# Altium schematic sheet stm32nes.SchDoc
size A3
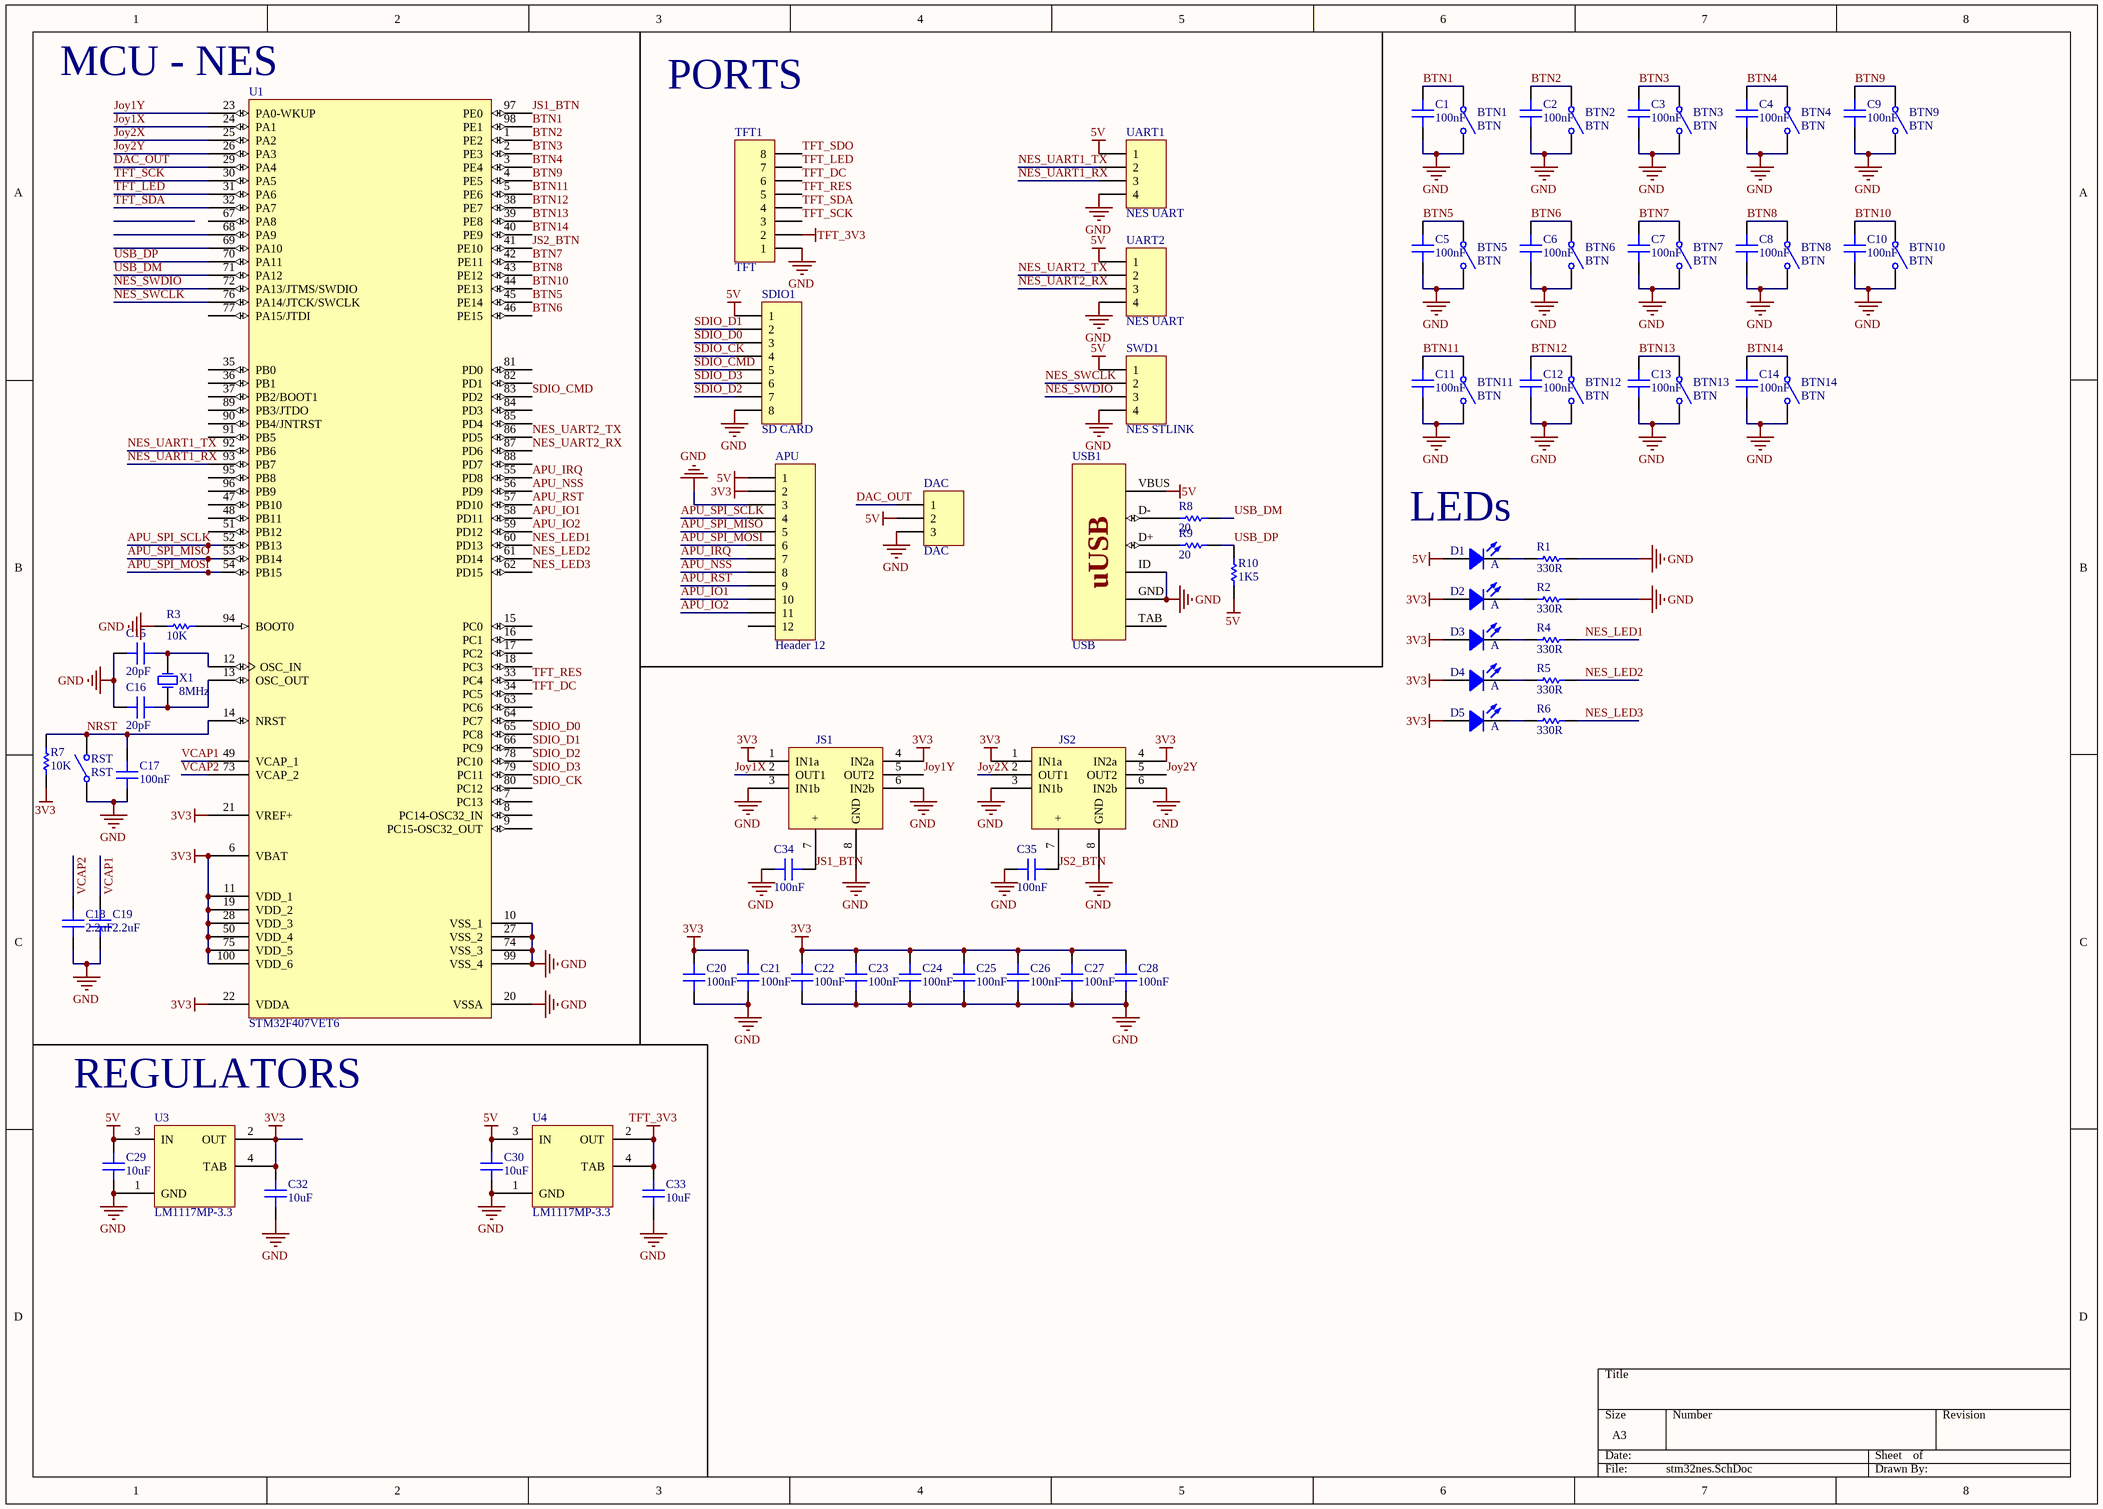
[diagram p0: stm32nes.SchDoc]

## Parts
APU  Header 12  [HDR1X12]
BTN1  BTN  [PCBComponent_1]
BTN2  BTN  [PCBComponent_1]
BTN3  BTN  [PCBComponent_1]
BTN4  BTN  [PCBComponent_1]
BTN5  BTN  [PCBComponent_1]
BTN6  BTN  [PCBComponent_1]
BTN7  BTN  [PCBComponent_1]
BTN8  BTN  [PCBComponent_1]
BTN9  BTN  [PCBComponent_1]
BTN10  BTN  [PCBComponent_1]
BTN11  BTN  [PCBComponent_1]
BTN12  BTN  [PCBComponent_1]
BTN13  BTN  [PCBComponent_1]
BTN14  BTN  [PCBComponent_1]
C1  100nF  [CC2012-0805]
C2  100nF  [CC2012-0805]
C3  100nF  [CC2012-0805]
C4  100nF  [CC2012-0805]
C5  100nF  [CC2012-0805]
C6  100nF  [CC2012-0805]
C7  100nF  [CC2012-0805]
C8  100nF  [CC2012-0805]
C9  100nF  [CC2012-0805]
C10  100nF  [CC2012-0805]
C11  100nF  [CC2012-0805]
C12  100nF  [CC2012-0805]
C13  100nF  [CC2012-0805]
C14  100nF  [CC2012-0805]
C15  20pF  [CC2012-0805]
C16  20pF  [CC2012-0805]
C17  100nF  [CC2012-0805]
C18  2.2uF  [CC2012-0805]
C19  2.2uF  [CC2012-0805]
C20  100nF  [CC2012-0805]
C21  100nF  [CC2012-0805]
C22  100nF  [CC2012-0805]
C23  100nF  [CC2012-0805]
C24  100nF  [CC2012-0805]
C25  100nF  [CC2012-0805]
C26  100nF  [CC2012-0805]
C27  100nF  [CC2012-0805]
C28  100nF  [CC2012-0805]
C29  10uF  [CC2012-0805]
C30  10uF  [CC2012-0805]
C32  10uF  [CC2012-0805]
C33  10uF  [CC2012-0805]
C34  100nF  [CC2012-0805]
C35  100nF  [CC2012-0805]
D1  A  [D0805]
D2  A  [D0805]
D3  A  [D0805]
D4  A  [D0805]
D5  A  [D0805]
DAC  DAC  [LOCKEDHDR-3W]
JS1  Joystick  [B10K-1]  (value not drawn)
JS2  Joystick  [B10K-1]  (value not drawn)
R1  330R  [CR2012-0805]
R2  330R  [CR2012-0805]
R3  10K  [CR2012-0805]
R4  330R  [CR2012-0805]
R5  330R  [CR2012-0805]
R6  330R  [CR2012-0805]
R7  10K  [CR2012-0805]
R8  20  [CR2012-0805]
R9  20  [CR2012-0805]
R10  1K5  [CR2012-0805]
RST  RST  [PUSH SWITCH 2-PIN]
SDIO1  SD CARD  [HDR1X8]
SWD1  NES STLINK  [LOCKEDHDR-4W]
TFT1  TFT  [HDR1X8]
U1  STM32F407VET6  [LQFP100_N]
U3  LM1117MP-3.3  [MP04A_N]
U4  LM1117MP-3.3  [MP04A_N]
UART1  NES UART  [LOCKEDHDR-4W]
UART2  NES UART  [LOCKEDHDR-4W]
USB1  USB  [USB-UB-S-HM]
X1  8MHz  [BCY-W2/E4.7]

## Nets
3V3: APU.2 C20.2 C21.2 C22.2 C23.2 C24.2 C25.2 C26.2 C27.2 C28.2 C32.2 D2.1(A) D3.1(A) D4.1(A) D5.1(A) JS1.1(IN1a) JS1.4(IN2a) JS2.1(IN1a) JS2.4(IN2a) R7.1 U1.6(VBAT) U1.11(VDD_1) U1.19(VDD_2) U1.21(VREF+) U1.22(VDDA) U1.28(VDD_3) U1.50(VDD_4) U1.75(VDD_5) U1.100(VDD_6) U3.2(OUT) U3.4(TAB)
5V: APU.1 C29.2 C30.2 D1.1(A) DAC.2 R10.2 SDIO1.1 SWD1.1 U3.3(IN) U4.3(IN) UART1.1 UART2.1 USB1.VBUS
GND: APU.3 BTN1.2(NO) BTN2.2(NO) BTN3.2(NO) BTN4.2(NO) BTN5.2(NO) BTN6.2(NO) BTN7.2(NO) BTN8.2(NO) BTN9.2(NO) BTN10.2(NO) BTN11.2(NO) BTN12.2(NO) BTN13.2(NO) BTN14.2(NO) C1.2 C2.2 C3.2 C4.2 C5.2 C6.2 C7.2 C8.2 C9.2 C10.2 C11.2 C12.2 C13.2 C14.2 C15.2 C16.2 C17.2 C18.1 C19.1 C20.1 C21.1 C22.1 C23.1 C24.1 C25.1 C26.1 C27.1 C28.1 C29.1 C30.1 C32.1 C33.1 C34.2 C35.2 DAC.3 JS1.3(IN1b) JS1.6(IN2b) JS1.8(GND) JS2.3(IN1b) JS2.6(IN2b) JS2.8(GND) R1.2 R2.2 R3.1 RST.1(COMMON) SDIO1.8 SWD1.4 TFT1.1 U1.10(VSS_1) U1.20(VSSA) U1.27(VSS_2) U1.74(VSS_3) U1.99(VSS_4) U3.1(GND) U4.1(GND) UART1.4 UART2.4 USB1.GND USB1.ID
TFT_3V3: C33.2 TFT1.2 U4.2(OUT) U4.4(TAB)
APU_IO1: APU.10 U1.58(PD11)
APU_IO2: APU.11 U1.59(PD12)
APU_IRQ: APU.7 U1.55(PD8)
APU_NSS: APU.8 U1.56(PD9)
APU_RST: APU.9 U1.57(PD10)
APU_SPI_MISO: APU.5 U1.53(PB14)
APU_SPI_MOSI: APU.6 U1.54(PB15)
APU_SPI_SCLK: APU.4 U1.52(PB13)
BTN1: BTN1.1(COMMON) C1.1 U1.98(PE1)
BTN2: BTN2.1(COMMON) C2.1 U1.1(PE2)
BTN3: BTN3.1(COMMON) C3.1 U1.2(PE3)
BTN4: BTN4.1(COMMON) C4.1 U1.3(PE4)
BTN5: BTN5.1(COMMON) C5.1 U1.45(PE14)
BTN6: BTN6.1(COMMON) C6.1 U1.46(PE15)
BTN7: BTN7.1(COMMON) C7.1 U1.42(PE11)
BTN8: BTN8.1(COMMON) C8.1 U1.43(PE12)
BTN9: BTN9.1(COMMON) C9.1 U1.4(PE5)
BTN10: BTN10.1(COMMON) C10.1 U1.44(PE13)
BTN11: BTN11.1(COMMON) C11.1 U1.5(PE6)
BTN12: BTN12.1(COMMON) C12.1 U1.38(PE7)
BTN13: BTN13.1(COMMON) C13.1 U1.39(PE8)
BTN14: BTN14.1(COMMON) C14.1 U1.40(PE9)
DAC_OUT: DAC.1 U1.29(PA4)
Joy1X: JS1.2(OUT1) U1.24(PA1)
Joy1Y: JS1.5(OUT2) U1.23(PA0-WKUP)
Joy2X: JS2.2(OUT1) U1.25(PA2)
Joy2Y: JS2.5(OUT2) U1.26(PA3)
JS1_BTN: C34.1 JS1.7(+) U1.97(PE0)
JS2_BTN: C35.1 JS2.7(+) U1.41(PE10)
NES_LED1: R4.2 U1.60(PD13)
NES_LED2: R5.2 U1.61(PD14)
NES_LED3: R6.2 U1.62(PD15)
NES_SWCLK: SWD1.2 U1.76(PA14/JTCK/SWCLK)
NES_SWDIO: SWD1.3 U1.72(PA13/JTMS/SWDIO)
NES_UART1_RX: U1.93(PB7) UART1.3
NES_UART1_TX: U1.92(PB6) UART1.2
NES_UART2_RX: U1.87(PD6) UART2.3
NES_UART2_TX: U1.86(PD5) UART2.2
NRST: C17.1 R7.2 RST.2(NO) U1.14(NRST)
SDIO_CK: SDIO1.4 U1.80(PC12)
SDIO_CMD: SDIO1.5 U1.83(PD2)
SDIO_D0: SDIO1.3 U1.65(PC8)
SDIO_D1: SDIO1.2 U1.66(PC9)
SDIO_D2: SDIO1.7 U1.78(PC10)
SDIO_D3: SDIO1.6 U1.79(PC11)
TFT_DC: TFT1.6 U1.34(PC5)
TFT_LED: TFT1.7 U1.31(PA6)
TFT_RES: TFT1.5 U1.33(PC4)
TFT_SCK: TFT1.3 U1.30(PA5)
TFT_SDA: TFT1.4 U1.32(PA7)
TFT_SDO: TFT1.8
USB_DM: R8.2 U1.71(PA12)
USB_DP: R9.2 R10.1 U1.70(PA11)
VCAP1: C19.2 U1.49(VCAP_1)
VCAP2: C18.2 U1.73(VCAP_2)
NetC15_1: C15.1 U1.12(OSC_IN) X1.2(OSC2)
NetC16_1: C16.1 U1.13(OSC_OUT) X1.1(OSC1)
NetD1_2: D1.2(K) R1.1
NetD2_2: D2.2(K) R2.1
NetD3_2: D3.2(K) R4.1
NetD4_2: D4.2(K) R5.1
NetD5_2: D5.2(K) R6.1
NetR3_2: R3.2 U1.94(BOOT0)
NetR8_1: R8.1 USB1.D-
NetR9_1: R9.1 USB1.D+

Not connected (* = marked no-connect by the designer): APU 12; U1 7(PC13) 8(PC14-OSC32_IN) 9(PC15-OSC32_OUT) 15(PC0) 16(PC1) 17(PC2) 18(PC3) 35(PB0) 36(PB1) 37(PB2/BOOT1) 47(PB10) 48(PB11) 51(PB12) 63(PC6) 64(PC7) 67(PA8) 68(PA9) 69(PA10) 77(PA15/JTDI) 81(PD0) 82(PD1) 84(PD3) 85(PD4) 88(PD7) 89(PB3/JTDO) 90(PB4/JNTRST) 91(PB5) 95(PB8) 96(PB9); USB1 TAB

## Notes on the sheet
- (near U1) MCU - NES
- PORTS
- (near D1) LEDs
- REGULATORS
- (in symbol USB Series Micro-B) uUSB

## Library data of the parts
APU = Header 12: Header, 12-Pin; LatestRevisionDate: 17-Jul-2002; LatestRevisionNote: Re-released for DXP Platform.; Publisher: Altium Limited
BTN1-BTN14 RST = SW-SPST: Single-Pole, Single-Throw Switch; Published: 24-Mar-1999; Revision: July-2002: Re-released for DXP Platform.; Publisher: Altium Limited
C1-C30 C32-C35 = Cap Semi: Capacitor (Semiconductor SIM Model); Published: 8-Jun-2000; LatestRevisionDate: 17-Jul-2002; LatestRevisionNote: Re-released for DXP Platform.; PackageReference: C1206; Publisher: Altium Limited
D1-D5 = LED: Typical RED GaAs LED; Published: 8-Jun-2000; LatestRevisionDate: 08-Jul-2005; LatestRevisionNote: Mech Layer 1 removed.; PackageReference: LED-1; Publisher: Altium Limited
DAC = Header 3: Header, 3-Pin; Revision: 17-Jul-2002: Re-released for DXP Platform.; Publisher: Altium Limited
JS1 JS2 = B10K-1
R1-R10 = Res Semi: Semiconductor Resistor; Published: 8-Jun-2000; LatestRevisionDate: 17-Jul-2002; LatestRevisionNote: Re-released for DXP Platform.; Publisher: Altium Limited
SDIO1 TFT1 = Header 8: Header, 8-Pin; LatestRevisionDate: 17-Jul-2002; LatestRevisionNote: Re-released for DXP Platform.; Publisher: Altium Limited
SWD1 UART1 UART2 = Header 4: Header, 4-Pin; Revision: 17-Jul-2002: Re-released for DXP Platform.; Publisher: Altium Limited
U1 = STM32F407VET6: STM32 ARM-based 32-bit MCU with 64 Kbytes Flash, 100-pin LQFP, Industrial Temperature; Published: 30-May-2008; DatasheetVersion: rev6, Mar-2008; PackageVersion: Mar-2008; PackageReference: LQFP100; Publisher: Altium Limited; PackageDescription: 100-Pin Low-Profile Quad Flat Pack, 14 x 14 mm Body, 0.5 mm Pitch (LQFP100); ComponentLink1Description: Manufacturer Link; ComponentLink1URL: www.st.com/stm32; ComponentLink2Description: Datasheet; ComponentLink2URL: http://www.st.com/stonline/products/literature/ds/13587.pdf
U3 U4 = LM1117MP-3.3: 800mA Low-Dropout Linear Regulator; Manufacturer: National Semiconductor; CompType: LDO IC; PackageTopMarking: XYTT*N05A; Published: 27-Nov-2008; DatasheetVersion: Apr-2006; PackageVersion: revB, Apr-2003; PackageReference: MP04A; Publisher: Altium Limited; PackageDescription: Molded SOT-223, 6.50 x 3.56 x 1.6mm Body, 4 Lead, 2.3mm Pitch; PartNumber: LM1117MP-3.3; RoHS: O; PinCount: 4; DigiKeyPartNumber: LM1117MP-3.3CT-ND; Code_JEDEC: TO-261-AA; Code_IPC: SOT223-4; ComponentLink1Description: LM1117 Datasheet; ComponentLink1URL: http://www.national.com/ds/LM/LM1117.pdf; ComponentLink2Description: LM1117 Web Page; ComponentLink2URL: http://www.national.com/pf/LM/LM1117.html; ComponentLink3Description: MP04A Package Page; ComponentLink3URL: http://www.national.com/packaging/folders/mp04a.html
USB1 = USB Series Micro-B
X1 = XTAL: Crystal Oscillator; Published: 8-Jun-2000; Revision: July-2002: Re-released for DXP Platform.; Publisher: Altium Limited